# EasyEDA schematic SCH_Mirge Driving Circuit and Power_2022-03-30.json
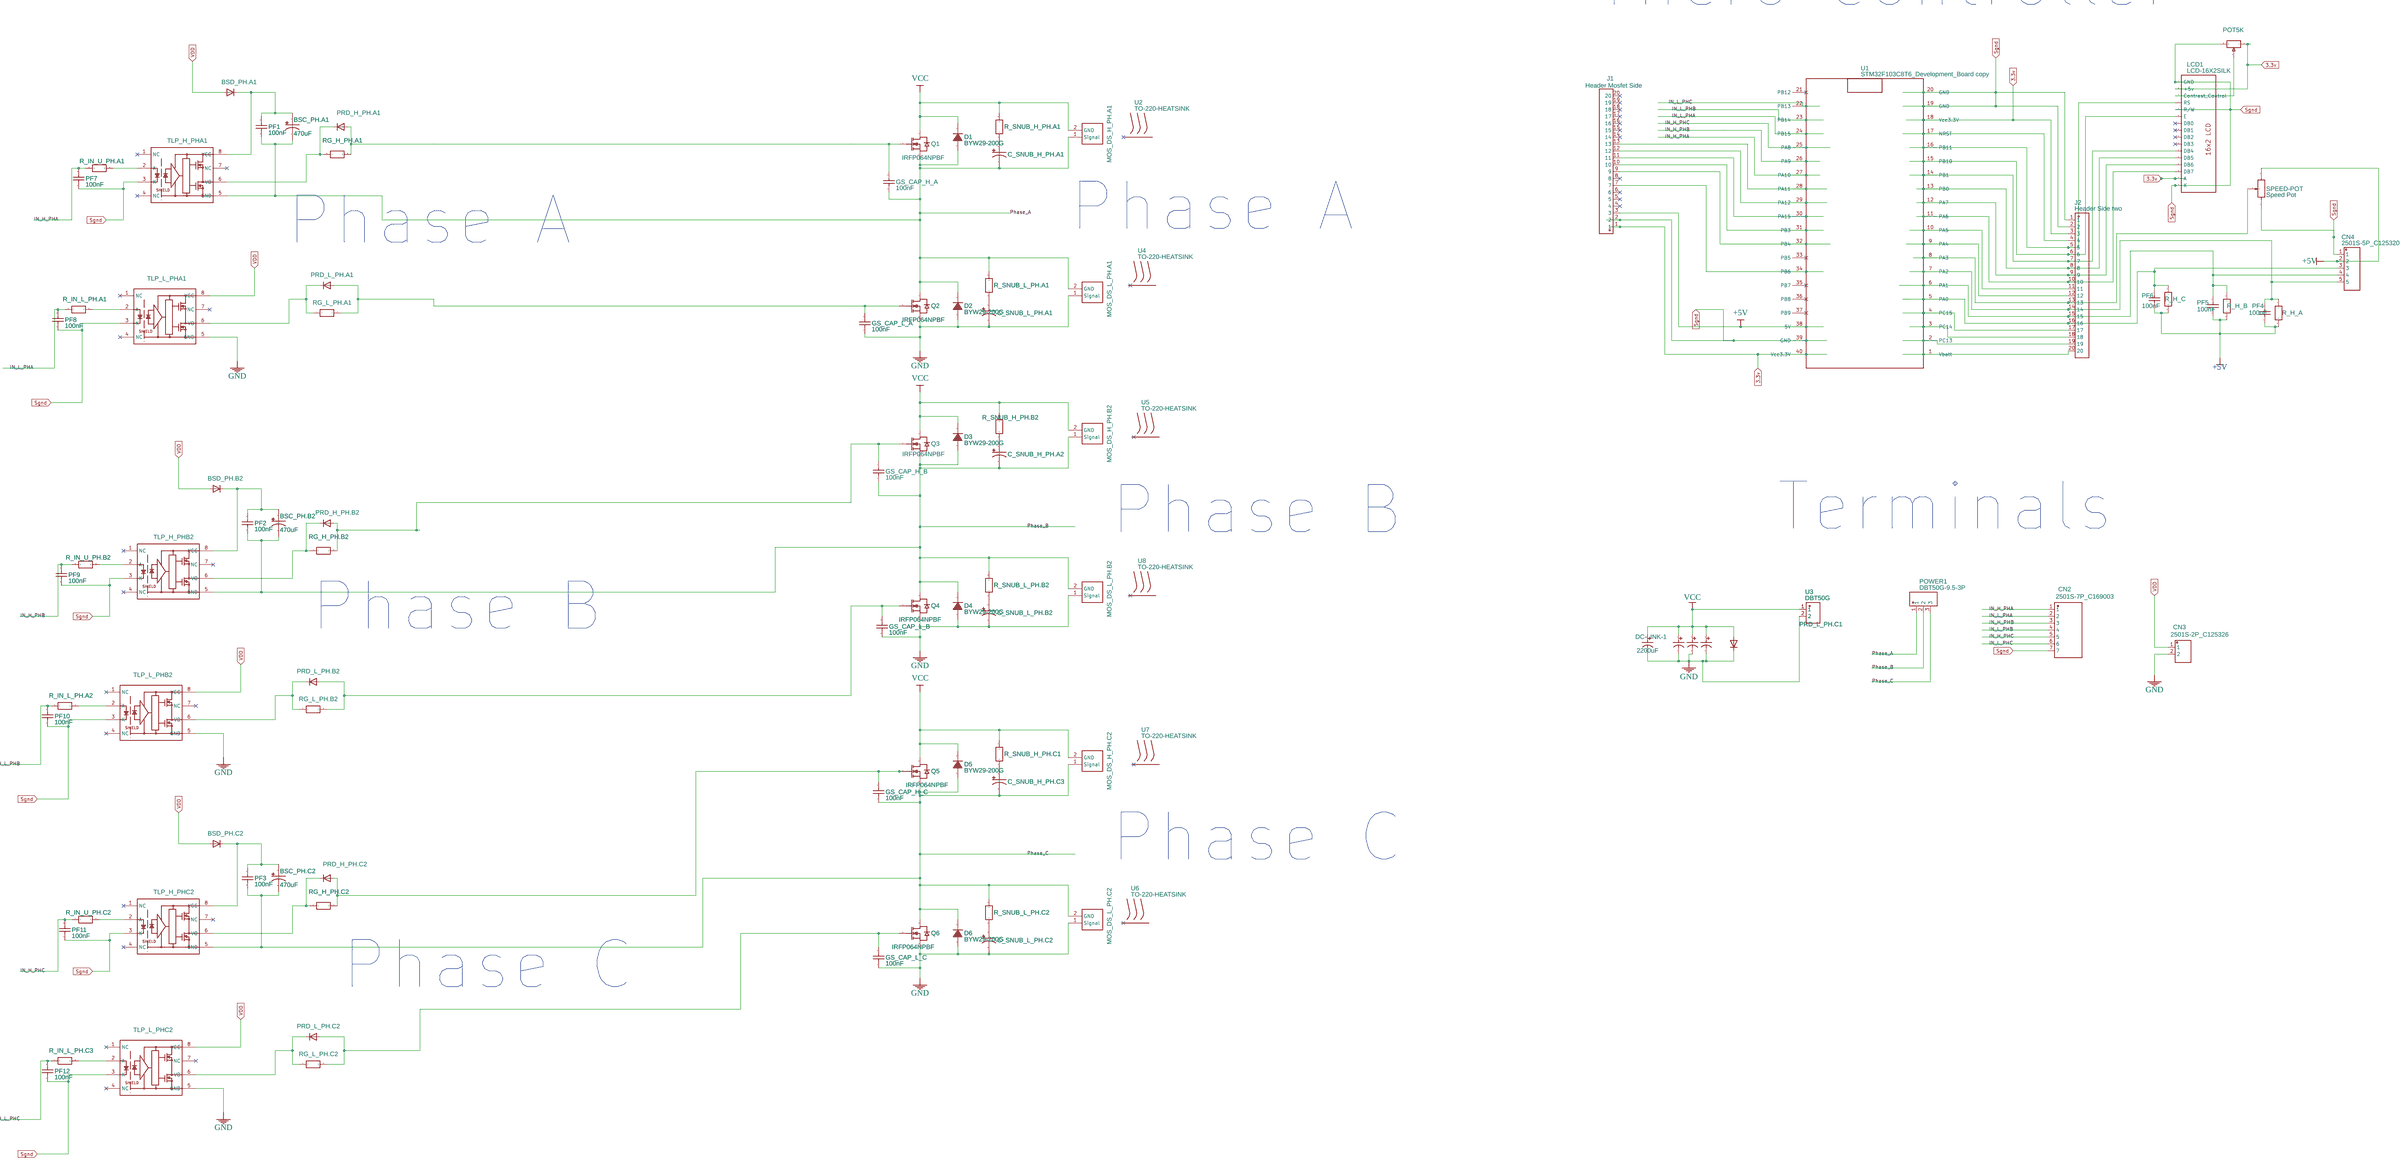
[diagram p0: schematic sheet]

## Parts
BSC_PH.A1  470uF  [CAP-TH_BD10.0-P5.00-D1.0-FD]
BSC_PH.B2  470uF  [CAP-TH_BD10.0-P5.00-D1.0-FD]
BSC_PH.C2  470uF  [CAP-TH_BD10.0-P5.00-D1.0-FD]
BSD_PH.A1  DIODEDO-1N4148  [DO-1N4148]
BSD_PH.B2  DIODEDO-1N4148  [DO-1N4148]
BSD_PH.C2  DIODEDO-1N4148  [DO-1N4148]
C_SNUB_H_PH.A1  470uF  [CAP-TH_BD10.0-P5.00-D1.0-FD]
C_SNUB_H_PH.A2  470uF  [CAP-TH_BD10.0-P5.00-D1.0-FD]
C_SNUB_H_PH.C3  470uF  [CAP-TH_BD10.0-P5.00-D1.0-FD]
C_SNUB_L_PH.A1  470uF  [CAP-TH_BD10.0-P5.00-D1.0-FD]
C_SNUB_L_PH.B2  470uF  [CAP-TH_BD10.0-P5.00-D1.0-FD]
C_SNUB_L_PH.C2  470uF  [CAP-TH_BD10.0-P5.00-D1.0-FD]
CN2  2501S-7P_C169003  [CONN-TH_7P-P2.54_2501S-7P]
CN3  2501S-2P_C125326  [CONN-TH_2P-P2.54_2501S-2P]
CN4  2501S-5P_C125320  [CONN-TH_5P-P2.54_2501S-5P]
D1  BYW29-200G  [TO-220AC-2_L10.0-W4.5-P5.08-T]
D2  BYW29-200G  [TO-220AC-2_L10.0-W4.5-P5.08-T]
D3  BYW29-200G  [TO-220AC-2_L10.0-W4.5-P5.08-T]
D4  BYW29-200G  [TO-220AC-2_L10.0-W4.5-P5.08-T]
D5  BYW29-200G  [TO-220AC-2_L10.0-W4.5-P5.08-T]
D6  BYW29-200G  [TO-220AC-2_L10.0-W4.5-P5.08-T]
DC-LINK-1  2200uF  [CAP-TH_BD18.0-P7.50-D1.2-FD]
DC-LINK-2  2200uF  [CAP-TH_BD18.0-P7.50-D1.2-FD]
DC-LINK-3  2200uF  [CAP-TH_BD18.0-P7.50-D1.2-FD]
DC-LINK-4  2200uF  [CAP-TH_BD18.0-P7.50-D1.2-FD]
GS_CAP_H_A  100nF  [CAPACITOR 104]
GS_CAP_H_B  100nF  [CAPACITOR 104]
GS_CAP_H_C  100nF  [CAPACITOR 104]
GS_CAP_L_A  100nF  [CAPACITOR 104]
GS_CAP_L_B  100nF  [CAPACITOR 104]
GS_CAP_L_C  100nF  [CAPACITOR 104]
J1  Header Mosfet Side  [HDR-TH_20P-P2.54-V-M-1]
J2  Header Side two  [HDR-TH_20P-P2.54-V-M-1]
LCD1  LCD-16X2SILK  [LCD-16X2]
MOS_DS_H_PH.A1  2 Pin Pinheader  [2 PIN PINHEADER]
MOS_DS_H_PH.B2  2 Pin Pinheader  [2 PIN PINHEADER]
MOS_DS_H_PH.C2  2 Pin Pinheader  [2 PIN PINHEADER]
MOS_DS_L_PH.A1  2 Pin Pinheader  [2 PIN PINHEADER]
MOS_DS_L_PH.B2  2 Pin Pinheader  [2 PIN PINHEADER]
MOS_DS_L_PH.C2  2 Pin Pinheader  [2 PIN PINHEADER]
PF1  100nF  [CAPACITOR 104]
PF2  100nF  [CAPACITOR 104]
PF3  100nF  [CAPACITOR 104]
PF4  100nF  [CAPACITOR 104]
PF5  100nF  [CAPACITOR 104]
PF6  100nF  [CAPACITOR 104]
PF7  100nF  [CAPACITOR 104]
PF8  100nF  [CAPACITOR 104]
PF9  100nF  [CAPACITOR 104]
PF10  100nF  [CAPACITOR 104]
PF11  100nF  [CAPACITOR 104]
PF12  100nF  [CAPACITOR 104]
POT5K  Potentiometer liegend Mini 6 mm  [POTENTIOMETER STEHEND MINI]
POWER1  DBT50G-9.5-3P  [CONN-TH_3P-P9.50_DBT50G-9.5-3P]
PRD_H_PH.A1  DIODE COPY  [DIODE-1N4001]
PRD_H_PH.B2  DIODE COPY  [DIODE-1N4001]
PRD_H_PH.C2  DIODE COPY  [DIODE-1N4001]
PRD_L_PH.A1  DIODE COPY  [DIODE-1N4001]
PRD_L_PH.B2  DIODE COPY  [DIODE-1N4001]
PRD_L_PH.C1  DIODE COPY  [DIODE-1N4001]
PRD_L_PH.C2  DIODE COPY  [DIODE-1N4001]
Q1  IRFP064NPBF  [TO-247AC-3_L15.8-W5.0-P5.46-L]
Q2  IRFP064NPBF  [TO-247AC-3_L15.8-W5.0-P5.46-L]
Q3  IRFP064NPBF  [TO-247AC-3_L15.8-W5.0-P5.46-L]
Q4  IRFP064NPBF  [TO-247AC-3_L15.8-W5.0-P5.46-L]
Q5  IRFP064NPBF  [TO-247AC-3_L15.8-W5.0-P5.46-L]
Q6  IRFP064NPBF  [TO-247AC-3_L15.8-W5.0-P5.46-L]
R_H_A  220K 0.25W-TH  [R_AXIAL-0.3]
R_H_B  220K 0.25W-TH  [R_AXIAL-0.3]
R_H_C  220K 0.25W-TH  [R_AXIAL-0.3]
R_IN_L_PH.A1  220K 0.25W-TH  [R_AXIAL-0.3]
R_IN_L_PH.A2  220K 0.25W-TH  [R_AXIAL-0.3]
R_IN_L_PH.C3  220K 0.25W-TH  [R_AXIAL-0.3]
R_IN_U_PH.A1  220K 0.25W-TH  [R_AXIAL-0.3]
R_IN_U_PH.B2  220K 0.25W-TH  [R_AXIAL-0.3]
R_IN_U_PH.C2  220K 0.25W-TH  [R_AXIAL-0.3]
R_SNUB_H_PH.A1  220K 0.25W-TH  [R_AXIAL-0.3]
R_SNUB_H_PH.B2  220K 0.25W-TH  [R_AXIAL-0.3]
R_SNUB_H_PH.C1  220K 0.25W-TH  [R_AXIAL-0.3]
R_SNUB_L_PH.A1  220K 0.25W-TH  [R_AXIAL-0.3]
R_SNUB_L_PH.B2  220K 0.25W-TH  [R_AXIAL-0.3]
R_SNUB_L_PH.C2  220K 0.25W-TH  [R_AXIAL-0.3]
RG_H_PH.A1  220K 0.25W-TH  [R_AXIAL-0.3]
RG_H_PH.B2  220K 0.25W-TH  [R_AXIAL-0.3]
RG_H_PH.C2  220K 0.25W-TH  [R_AXIAL-0.3]
RG_L_PH.A1  220K 0.25W-TH  [R_AXIAL-0.3]
RG_L_PH.B2  220K 0.25W-TH  [R_AXIAL-0.3]
RG_L_PH.C2  220K 0.25W-TH  [R_AXIAL-0.3]
SPEED-POT  Speed Pot  [POTENTIOMETER]
TLP_H_PHA1  TLP350(F)  [DIP-8_L9.8-W6.6-P2.54-LS7.6-BL]
TLP_H_PHB2  TLP350(F)  [DIP-8_L9.8-W6.6-P2.54-LS7.6-BL]
TLP_H_PHC2  TLP350(F)  [DIP-8_L9.8-W6.6-P2.54-LS7.6-BL]
TLP_L_PHA1  TLP350(F)  [DIP-8_L9.8-W6.6-P2.54-LS7.6-BL]
TLP_L_PHB2  TLP350(F)  [DIP-8_L9.8-W6.6-P2.54-LS7.6-BL]
TLP_L_PHC2  TLP350(F)  [DIP-8_L9.8-W6.6-P2.54-LS7.6-BL]
U1  STM32F103C8T6_Development_Board copy  [STM32F103C8T6-BLUEPILL]
U2  TO-220-HEATSINK  [TO-220-HEATSINK]
U3  DBT50G  [CONN-TH_2P-P9.50_DBT50G-9.5-2P]
U4  TO-220-HEATSINK  [TO-220-HEATSINK]
U5  TO-220-HEATSINK  [TO-220-HEATSINK]
U6  TO-220-HEATSINK  [TO-220-HEATSINK]
U7  TO-220-HEATSINK  [TO-220-HEATSINK]
U8  TO-220-HEATSINK  [TO-220-HEATSINK]

## Library data of the parts
BSC_PH.A1 BSC_PH.B2 BSC_PH.C2 C_SNUB_H_PH.A1 C_SNUB_H_PH.A2 C_SNUB_H_PH.C3 C_SNUB_L_PH.A1 C_SNUB_L_PH.B2 C_SNUB_L_PH.C2 = RD1E477M1012MPA18P: Supplier: LCSC; Supplier Part: C160623; Manufacturer: Samwha Capacitor; Contributor: LCSC; JLCPCB Part Class: Extended Part
BSD_PH.A1 BSD_PH.B2 BSD_PH.C2 = DIODEDO-1N4148: Contributor: raiyan
CN2 = 2501S-7P_C169003: Supplier: LCSC; Supplier Part: C169003; Manufacturer: Shenzhen Cankemeng; Contributor: 立创EDA官方封装库; JLCPCB Part Class: Extended Part
CN3 = 2501S-2P_C125326: Supplier: LCSC; Manufacturer: Ckmtw; Manufacturer Part: 2501S-2P; Contributor: 立创EDA官方封装库; Supplier Part: C125326; JLCPCB Part Class: Extended Part
CN4 = 2501S-5P_C125320: Supplier: LCSC; Manufacturer: Ckmtw; Manufacturer Part: 2501S-5P; Contributor: 立创EDA官方封装库; Supplier Part: C125320; JLCPCB Part Class: Extended Part
D1-D6 = BYW29-200G: Supplier: LCSC; Supplier Part: C232399; Manufacturer: ON Semicon; Contributor: LCSC; JLCPCB Part Class: Extended Part
DC-LINK-1-DC-LINK-4 = 2200uF 63V 18*30: Supplier: LCSC; Manufacturer: ValuePro; Supplier Part: C47858; JLCPCB Part Class: Extended Part
GS_CAP_H_A GS_CAP_H_B GS_CAP_H_C GS_CAP_L_A GS_CAP_L_B GS_CAP_L_C PF1-PF12 = capacitor100nF（104）100V: Supplier: LCSC; Manufacturer: ReliaPro; Manufacturer Part: Calibration capacitor100nF（104）100V,5%; Supplier Part: C26609; Contributor: elnino
J1 J2 = Header-Male-2.54_1x20: Supplier: LCSC; Manufacturer: BOOMELE; Manufacturer Part: 2.54mm 1*20PHeader; Supplier Part: C50981; JLCPCB Part Class: Extended Part
LCD1 = LCD-16X2SILK: Contributor: Aman.Singh Btech2018
MOS_DS_H_PH.A1 MOS_DS_H_PH.B2 MOS_DS_H_PH.C2 MOS_DS_L_PH.A1 MOS_DS_L_PH.B2 MOS_DS_L_PH.C2 = 2 Pin Pinheader: Contributor: Snowcastle
POT5K = Potentiometer liegend Mini 6 mm: Supplier Part: ?; Contributor: LCEDA_Lib; Value(Ω): 10K
POWER1 = DBT50G-9.5-3P: Supplier: LCSC; Supplier Part: C395959; Manufacturer: DIBO; Contributor: LCSC; JLCPCB Part Class: Extended Part
PRD_H_PH.A1 PRD_H_PH.B2 PRD_H_PH.C2 PRD_L_PH.A1 PRD_L_PH.B2 PRD_L_PH.C1 PRD_L_PH.C2 = DIODE COPY: Contributor: SparkFun
Q1-Q6 = IRFP064NPBF: Supplier: LCSC; Manufacturer: IR; Supplier Part: C9205; JLCPCB Part Class: Extended Part
R_H_A R_H_B R_H_C R_IN_L_PH.A1 R_IN_L_PH.A2 R_IN_L_PH.C3 R_IN_U_PH.A1 R_IN_U_PH.B2 R_IN_U_PH.C2 R_SNUB_H_PH.A1 R_SNUB_H_PH.B2 R_SNUB_H_PH.C1 R_SNUB_L_PH.A1 R_SNUB_L_PH.B2 R_SNUB_L_PH.C2 RG_H_PH.A1 RG_H_PH.B2 RG_H_PH.C2 RG_L_PH.A1 RG_L_PH.B2 RG_L_PH.C2 = 220K 0.25W-TH: Contributor: rifanoz
SPEED-POT = POTENTIOMETER: Contributor: KiCad; sourceId: nt3DAaKIG
TLP_H_PHA1 TLP_H_PHB2 TLP_H_PHC2 TLP_L_PHA1 TLP_L_PHB2 TLP_L_PHC2 = TLP350(F): Supplier: LCSC; Manufacturer: TOSHIBA; Supplier Part: C50232; JLCPCB Part Class: Extended Part
U1 = STM32F103C8T6_Development_Board copy: Manufacturer Part: STM32Duino; Contributor: Johan_a
U2 U4-U8 = TO-220-HEATSINK: Contributor: AtifIqbal
U3 = DBT50G-9.5-2P: Supplier: LCSC; Supplier Part: C395958; Manufacturer: DIBO; Contributor: LCSC

## Nets
3.3v: J1.1 J2.3 LCD1.2(+5v) LCD1.15(A) POT5K.1 U1.18(Vcc3.3V) U1.40(Vcc3.3V)
+5V: CN4.2 J1.3 PF4.1 PF5.2 PF6.2 R_H_A.2 R_H_B.2 R_H_C.2 SPEED-POT.3 U1.38(5V)
GND: C_SNUB_L_PH.A1.2 C_SNUB_L_PH.B2.2 C_SNUB_L_PH.C2.2 CN3.2 D2.3(A) D4.3(A) D6.3(A) DC-LINK-1.2 DC-LINK-2.2 DC-LINK-3.2 DC-LINK-4.2 GS_CAP_L_A.1 GS_CAP_L_B.1 GS_CAP_L_C.1 MOS_DS_L_PH.A1.1(Signal) MOS_DS_L_PH.B2.1(Signal) MOS_DS_L_PH.C2.1(Signal) PRD_L_PH.C1.C Q2.3(S) Q4.3(S) Q6.3(S) TLP_L_PHA1.5(GND) TLP_L_PHB2.5(GND) TLP_L_PHC2.5(GND) U3.2
Sgnd: CN2.7 CN4.1 J1.2 J2.1 J2.2 LCD1.1(GND) LCD1.5(R/W) LCD1.16(K) PF7.1 PF8.1 PF9.1 PF10.1 PF11.1 PF12.1 POT5K.3 SPEED-POT.1 TLP_H_PHA1.3(K) TLP_H_PHB2.3(K) TLP_H_PHC2.3(K) TLP_L_PHA1.3(K) TLP_L_PHB2.3(K) TLP_L_PHC2.3(K) U1.19(GND) U1.20(GND) U1.39(GND)
VCC: D1.1(K) D3.1(K) D5.1(K) DC-LINK-1.1 DC-LINK-2.1 DC-LINK-3.1 DC-LINK-4.1 MOS_DS_H_PH.A1.2(GND) MOS_DS_H_PH.B2.2(GND) MOS_DS_H_PH.C2.2(GND) PRD_L_PH.C1.A Q1.2(D) Q3.2(D) Q5.2(D) R_SNUB_H_PH.A1.2 R_SNUB_H_PH.B2.2 R_SNUB_H_PH.C1.2 U3.1
VDD: BSD_PH.A1.A BSD_PH.B2.A BSD_PH.C2.A CN3.1 TLP_L_PHA1.8(VCC) TLP_L_PHB2.8(VCC) TLP_L_PHC2.8(VCC)
IN_H_PHA: CN2.1 PF7.2 R_IN_U_PH.A1.1 U1.27(PA10)
IN_H_PHB: CN2.3 PF9.2 R_IN_U_PH.B2.1 U1.26(PA9)
IN_H_PHC: CN2.5 PF11.2 R_IN_U_PH.C2.1 U1.25(PA8)
IN_L_PHA: CN2.2 PF8.2 R_IN_L_PH.A1.1 U1.24(PB15)
IN_L_PHB: CN2.4 PF10.2 R_IN_L_PH.A2.1 U1.23(PB14)
IN_L_PHC: CN2.6 PF12.2 R_IN_L_PH.C3.1 U1.22(PB13)
Phase_A: BSC_PH.A1.2 C_SNUB_H_PH.A1.2 D1.3(A) D2.1(K) GS_CAP_H_A.1 MOS_DS_H_PH.A1.1(Signal) MOS_DS_L_PH.A1.2(GND) PF1.1 POWER1.1 Q1.3(S) Q2.2(D) R_SNUB_L_PH.A1.2 TLP_H_PHA1.5(GND)
Phase_B: BSC_PH.B2.2 C_SNUB_H_PH.A2.2 D3.3(A) D4.1(K) GS_CAP_H_B.1 MOS_DS_H_PH.B2.1(Signal) MOS_DS_L_PH.B2.2(GND) PF2.1 POWER1.2 Q3.3(S) Q4.2(D) R_SNUB_L_PH.B2.2 TLP_H_PHB2.5(GND)
Phase_C: BSC_PH.C2.2 C_SNUB_H_PH.C3.2 D5.3(A) D6.1(K) GS_CAP_H_C.1 MOS_DS_H_PH.C2.1(Signal) MOS_DS_L_PH.C2.2(GND) PF3.1 POWER1.3 Q5.3(S) Q6.2(D) R_SNUB_L_PH.C2.2 TLP_H_PHC2.5(GND)
Net-(BSC_PH.A1-1): BSC_PH.A1.1 BSD_PH.A1.C PF1.2 TLP_H_PHA1.8(VCC)
Net-(BSC_PH.B2-1): BSC_PH.B2.1 BSD_PH.B2.C PF2.2 TLP_H_PHB2.8(VCC)
Net-(BSC_PH.C2-1): BSC_PH.C2.1 BSD_PH.C2.C PF3.2 TLP_H_PHC2.8(VCC)
Net-(C_SNUB_H_PH.A1-1): C_SNUB_H_PH.A1.1 R_SNUB_H_PH.A1.1
Net-(C_SNUB_H_PH.A2-1): C_SNUB_H_PH.A2.1 R_SNUB_H_PH.B2.1
Net-(C_SNUB_H_PH.C3-1): C_SNUB_H_PH.C3.1 R_SNUB_H_PH.C1.1
Net-(C_SNUB_L_PH.A1-1): C_SNUB_L_PH.A1.1 R_SNUB_L_PH.A1.1
Net-(C_SNUB_L_PH.B2-1): C_SNUB_L_PH.B2.1 R_SNUB_L_PH.B2.1
Net-(C_SNUB_L_PH.C2-1): C_SNUB_L_PH.C2.1 R_SNUB_L_PH.C2.1
Net-(CN4-3): CN4.3 J2.16 PF6.1 R_H_C.1 U1.5(PA0)
Net-(CN4-4): CN4.4 J2.15 PF5.1 R_H_B.1 U1.6(PA1)
Net-(CN4-5): CN4.5 J2.14 PF4.2 R_H_A.1 U1.7(PA2)
Net-(GS_CAP_H_A-2): GS_CAP_H_A.2 PRD_H_PH.A1.A Q1.1(G) RG_H_PH.A1.2
Net-(GS_CAP_H_B-2): GS_CAP_H_B.2 PRD_H_PH.B2.A Q3.1(G) RG_H_PH.B2.2
Net-(GS_CAP_H_C-2): GS_CAP_H_C.2 PRD_H_PH.C2.A Q5.1(G) RG_H_PH.C2.2
Net-(GS_CAP_L_A-2): GS_CAP_L_A.2 PRD_L_PH.A1.A Q2.1(G) RG_L_PH.A1.2
Net-(GS_CAP_L_B-2): GS_CAP_L_B.2 PRD_L_PH.B2.A Q4.1(G) RG_L_PH.B2.2
Net-(GS_CAP_L_C-2): GS_CAP_L_C.2 PRD_L_PH.C2.A Q6.1(G) RG_L_PH.C2.2
Net-(J1-7): J1.7 U1.34(PB6)
Net-(J1-9): J1.9 U1.32(PB4)
Net-(J1-10): J1.10 U1.31(PB3)
Net-(J1-11): J1.11 U1.30(PA15)
Net-(J1-12): J1.12 U1.29(PA12)
Net-(J1-13): J1.13 U1.28(PA11)
Net-(J2-4): J2.4 U1.17(NRST)
Net-(J2-5): J2.5 LCD1.4(RS) U1.16(PB11)
Net-(J2-6): J2.6 LCD1.6(E) U1.15(PB10)
Net-(J2-7): J2.7 LCD1.11(DB4) U1.14(PB1)
Net-(J2-8): J2.8 LCD1.12(DB5) U1.13(PB0)
Net-(J2-9): J2.9 LCD1.13(DB6) U1.12(PA7)
Net-(J2-10): J2.10 LCD1.14(DB7) U1.11(PA6)
Net-(J2-11): J2.11 U1.10(PA5)
Net-(J2-12): J2.12 U1.9(PA4)
Net-(J2-13): J2.13 SPEED-POT.2 U1.8(PA3)
Net-(J2-17): J2.17 U1.4(PC15)
Net-(J2-18): J2.18 U1.3(PC14)
Net-(J2-19): J2.19 U1.2(PC13)
Net-(J2-20): J2.20 U1.1(Vbatt)
Net-(LCD1-3): LCD1.3(Contrast Control) POT5K.2
Net-(PRD_H_PH.A1-C): PRD_H_PH.A1.C RG_H_PH.A1.1 TLP_H_PHA1.6(VO)
Net-(PRD_H_PH.B2-C): PRD_H_PH.B2.C RG_H_PH.B2.1 TLP_H_PHB2.6(VO)
Net-(PRD_H_PH.C2-C): PRD_H_PH.C2.C RG_H_PH.C2.1 TLP_H_PHC2.6(VO)
Net-(PRD_L_PH.A1-C): PRD_L_PH.A1.C RG_L_PH.A1.1 TLP_L_PHA1.6(VO)
Net-(PRD_L_PH.B2-C): PRD_L_PH.B2.C RG_L_PH.B2.1 TLP_L_PHB2.6(VO)
Net-(PRD_L_PH.C2-C): PRD_L_PH.C2.C RG_L_PH.C2.1 TLP_L_PHC2.6(VO)
Net-(R_IN_L_PH.A1-2): R_IN_L_PH.A1.2 TLP_L_PHA1.2(A)
Net-(R_IN_L_PH.A2-2): R_IN_L_PH.A2.2 TLP_L_PHB2.2(A)
Net-(R_IN_L_PH.C3-2): R_IN_L_PH.C3.2 TLP_L_PHC2.2(A)
Net-(R_IN_U_PH.A1-2): R_IN_U_PH.A1.2 TLP_H_PHA1.2(A)
Net-(R_IN_U_PH.B2-2): R_IN_U_PH.B2.2 TLP_H_PHB2.2(A)
Net-(R_IN_U_PH.C2-2): R_IN_U_PH.C2.2 TLP_H_PHC2.2(A)

Not connected (* = marked no-connect by the designer): J1 4* 5* 6* 8* 14* 15* 16* 17* 18* 19* 20*; LCD1 7(DB0)* 8(DB1)* 9(DB2)* 10(DB3)*; TLP_H_PHA1 1(NC)* 4(NC)* 7(NC)*; TLP_H_PHB2 1(NC)* 4(NC)* 7(NC)*; TLP_H_PHC2 1(NC)* 4(NC)* 7(NC)*; TLP_L_PHA1 1(NC)* 4(NC)* 7(NC)*; TLP_L_PHB2 1(NC)* 4(NC)* 7(NC)*; TLP_L_PHC2 1(NC)* 4(NC)* 7(NC)*; U1 21(PB12)* 33(PB5)* 35(PB7)* 36(PB8)* 37(PB9)*

## Notes on the sheet
- Micro controller
- Phase A
- Phase A
- Phase B
- Terminals
- Phase B
- Phase C
- Phase C
